# Altium schematic sheet MCU_sensor_peripherial.SchDoc
size 420 x 297 mm; SheetNumber: 4; SheetTotal: 4
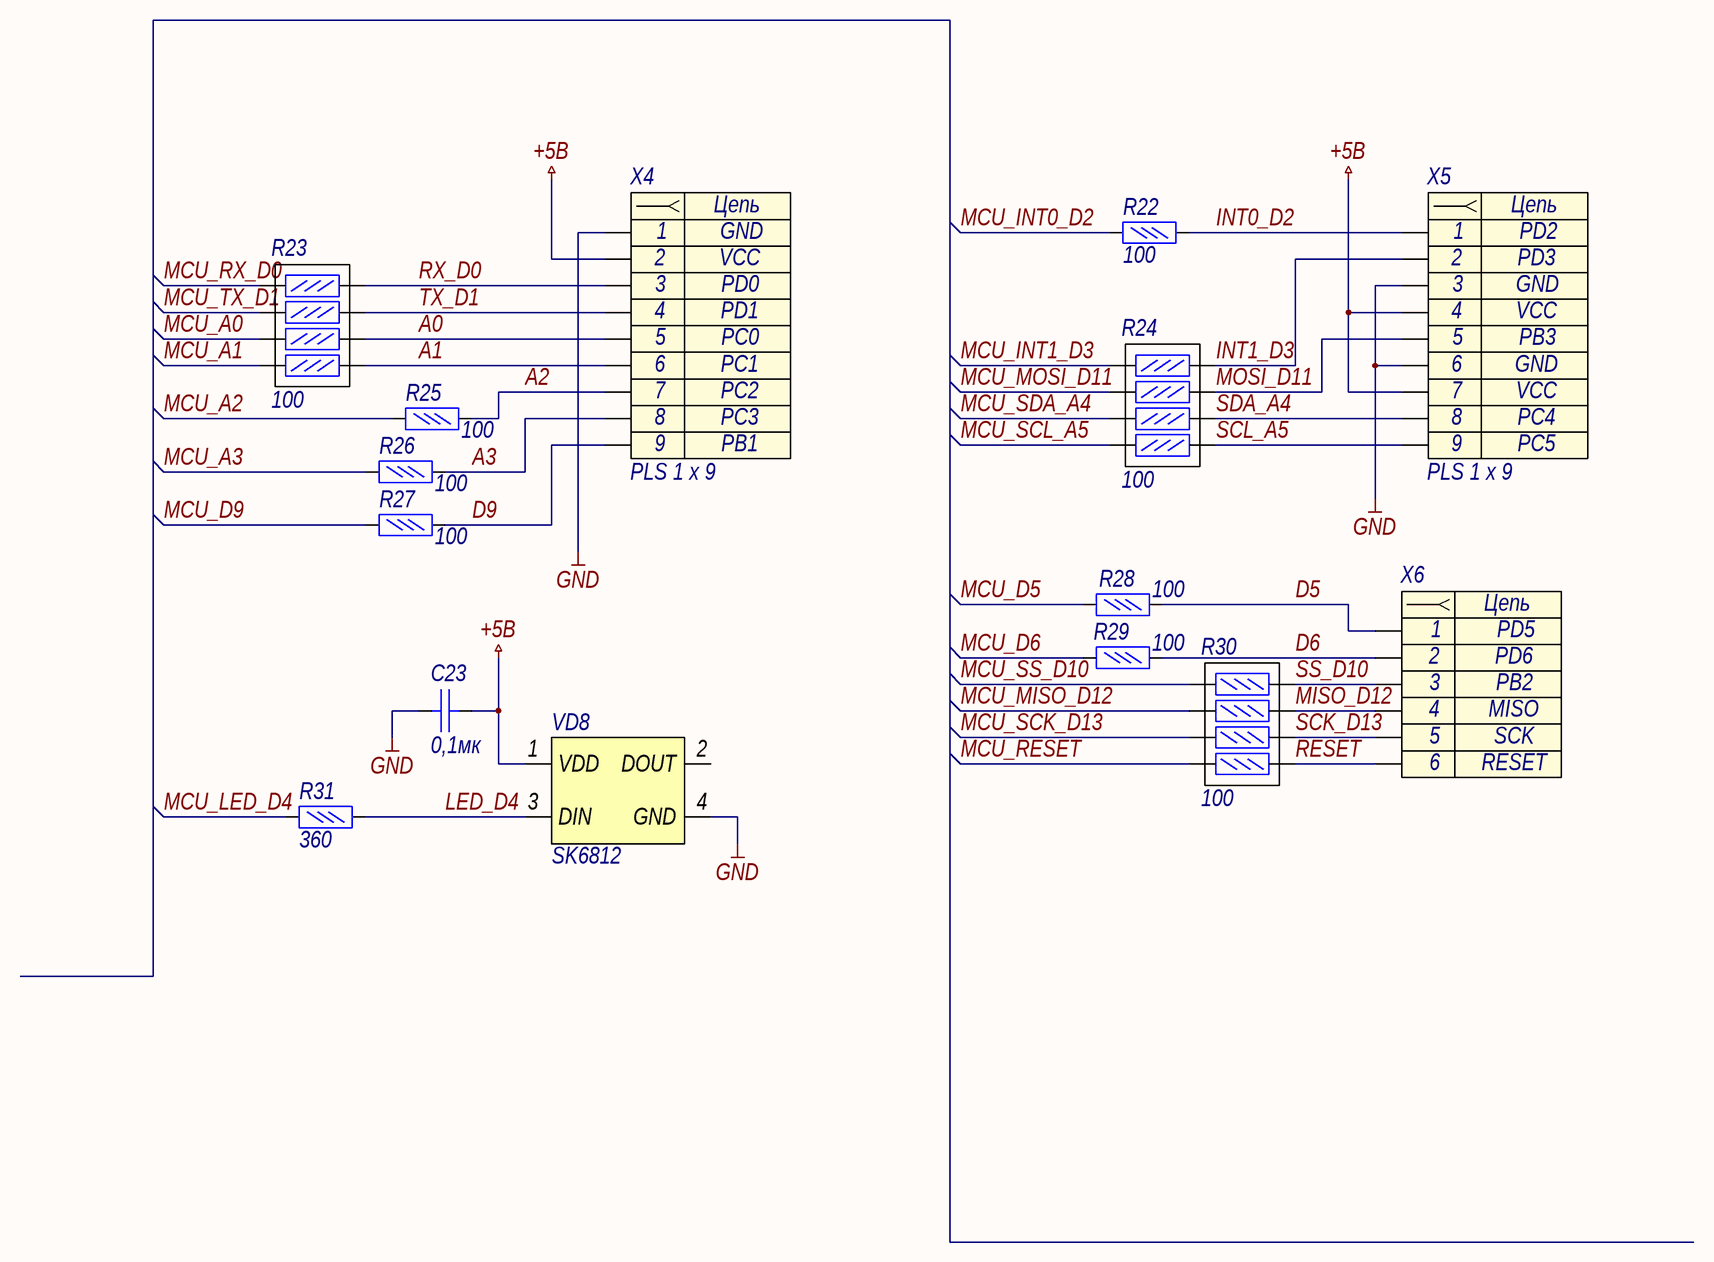
[diagram p0: MCU_sensor_peripherial.SchDoc]

## Parts
R22  100  [R0402]
R23  100  [R0402x4]
R24  100  [R0402x4]
R25  100  [R0402]
R26  100  [R0402]
R27  100  [R0402]
R28  100  [R0402]
R29  100  [R0402]
R30  100  [R0402x4]
R31  360  [R0402]
VD8  SK6812  [3535]
X4  PLS 1 x 9  [PLS2-9 - emty]
X5  PLS 1 x 9  [PLS2-9 - emty]
X6  (no value)  [PLS2-6 - emty]
С23  0,1мк  [C0402]

## Nets
+5В: VD8.1(VDD) X4.2 X5.4 X5.7 С23.2
GND: VD8.4(GND) X4.1 X5.3 X5.6 С23.1
A0: R23.5 X4.5
A1: R23.7 X4.6
A2: R25.2 X4.7
A3: R26.2 X4.8
D5: R28.2 X6.1
D6: R29.2 X6.2
D9: R27.2 X4.9
INT0_D2: R22.2 X5.1
INT1_D3: R24.1 X5.2
LED_D4: R31.2 VD8.3(DIN)
MCU_A0: R23.6
MCU_A1: R23.8
MCU_A2: R25.1
MCU_A3: R26.1
MCU_D5: R28.1
MCU_D6: R29.1
MCU_D9: R27.1
MCU_INT0_D2: R22.1
MCU_INT1_D3: R24.2
MCU_LED_D4: R31.1
MCU_MISO_D12: R30.3
MCU_MOSI_D11: R24.4
MCU_RESET: R30.7
MCU_RX_D0: R23.2
MCU_SCK_D13: R30.5
MCU_SCL_A5: R24.8
MCU_SDA_A4: R24.6
MCU_SS_D10: R30.1
MCU_TX_D1: R23.4
MISO_D12: R30.4 X6.4
MOSI_D11: R24.3 X5.5
RESET: R30.8 X6.6
RX_D0: R23.1 X4.3
SCK_D13: R30.6 X6.5
SCL_A5: R24.7 X5.9
SDA_A4: R24.5 X5.8
SS_D10: R30.2 X6.3
TX_D1: R23.3 X4.4

Not connected (* = marked no-connect by the designer): VD8 2(DOUT)

## Notes on the sheet
- Подп. и дата
- Инв. № дубл.
- Взам. инв. №
- Инв. № подл.
- Лист
- Изм.
- № докум.
- Подп.
- Дата
- Копировал
- Формат
- А3
- (in symbol PLS 1 x 6) Цепь
- (in symbol PLS 1 x 9) Цепь

## Library data of the parts
R22 R25-R29 R31 = Резистор 0.05Вт: Резистор 0,05Вт
  R22 R25-R29: Value: 100
  R31: Value: 360
R23 R24 R30 = Резисторная сборка 0.05 x 4: Value: 100
VD8 = SK6812: светодиод с пиксельной адресацией SK6812 4020; Name: SK6812
X4 = PLS 1 x 9: Contact_1: GND; Contact_2: VCC; Contact_3: PD0; Contact_4: PD1; Contact_5: PC0; Contact_6: PC1; Contact_7: PC2; Contact_8: PC3; Contact_9: PB1; Name: PLS 1 x 9
X5 = PLS 1 x 9: Contact_1: PD2; Contact_2: PD3; Contact_3: GND; Contact_4: VCC; Contact_5: PB3; Contact_8: PC4; Contact_9: PC5; Contact_6: GND; Contact_7: VCC; Name: PLS 1 x 9
X6 = PLS 1 x 6: Contact_1: PD5; Contact_2: PD6; Contact_3: PB2; Contact_4: MISO; Contact_5: SCK; Contact_6: RESET; Name: PLS 1 x 6
С23 = Кер. конденсатор: Value: 0,1мк